# Altium schematic sheet DM1097_MIPI_IO.SchDoc: =project_title
size Tabloid; CompanyName: Luxonis Holding; Organization: Luxonis Holding; Address1: 1925 Harmony Park Drive; Address2: Westminster, CO; Address3: 80234; Address4: United States; SheetNumber: 13; SheetTotal: 17
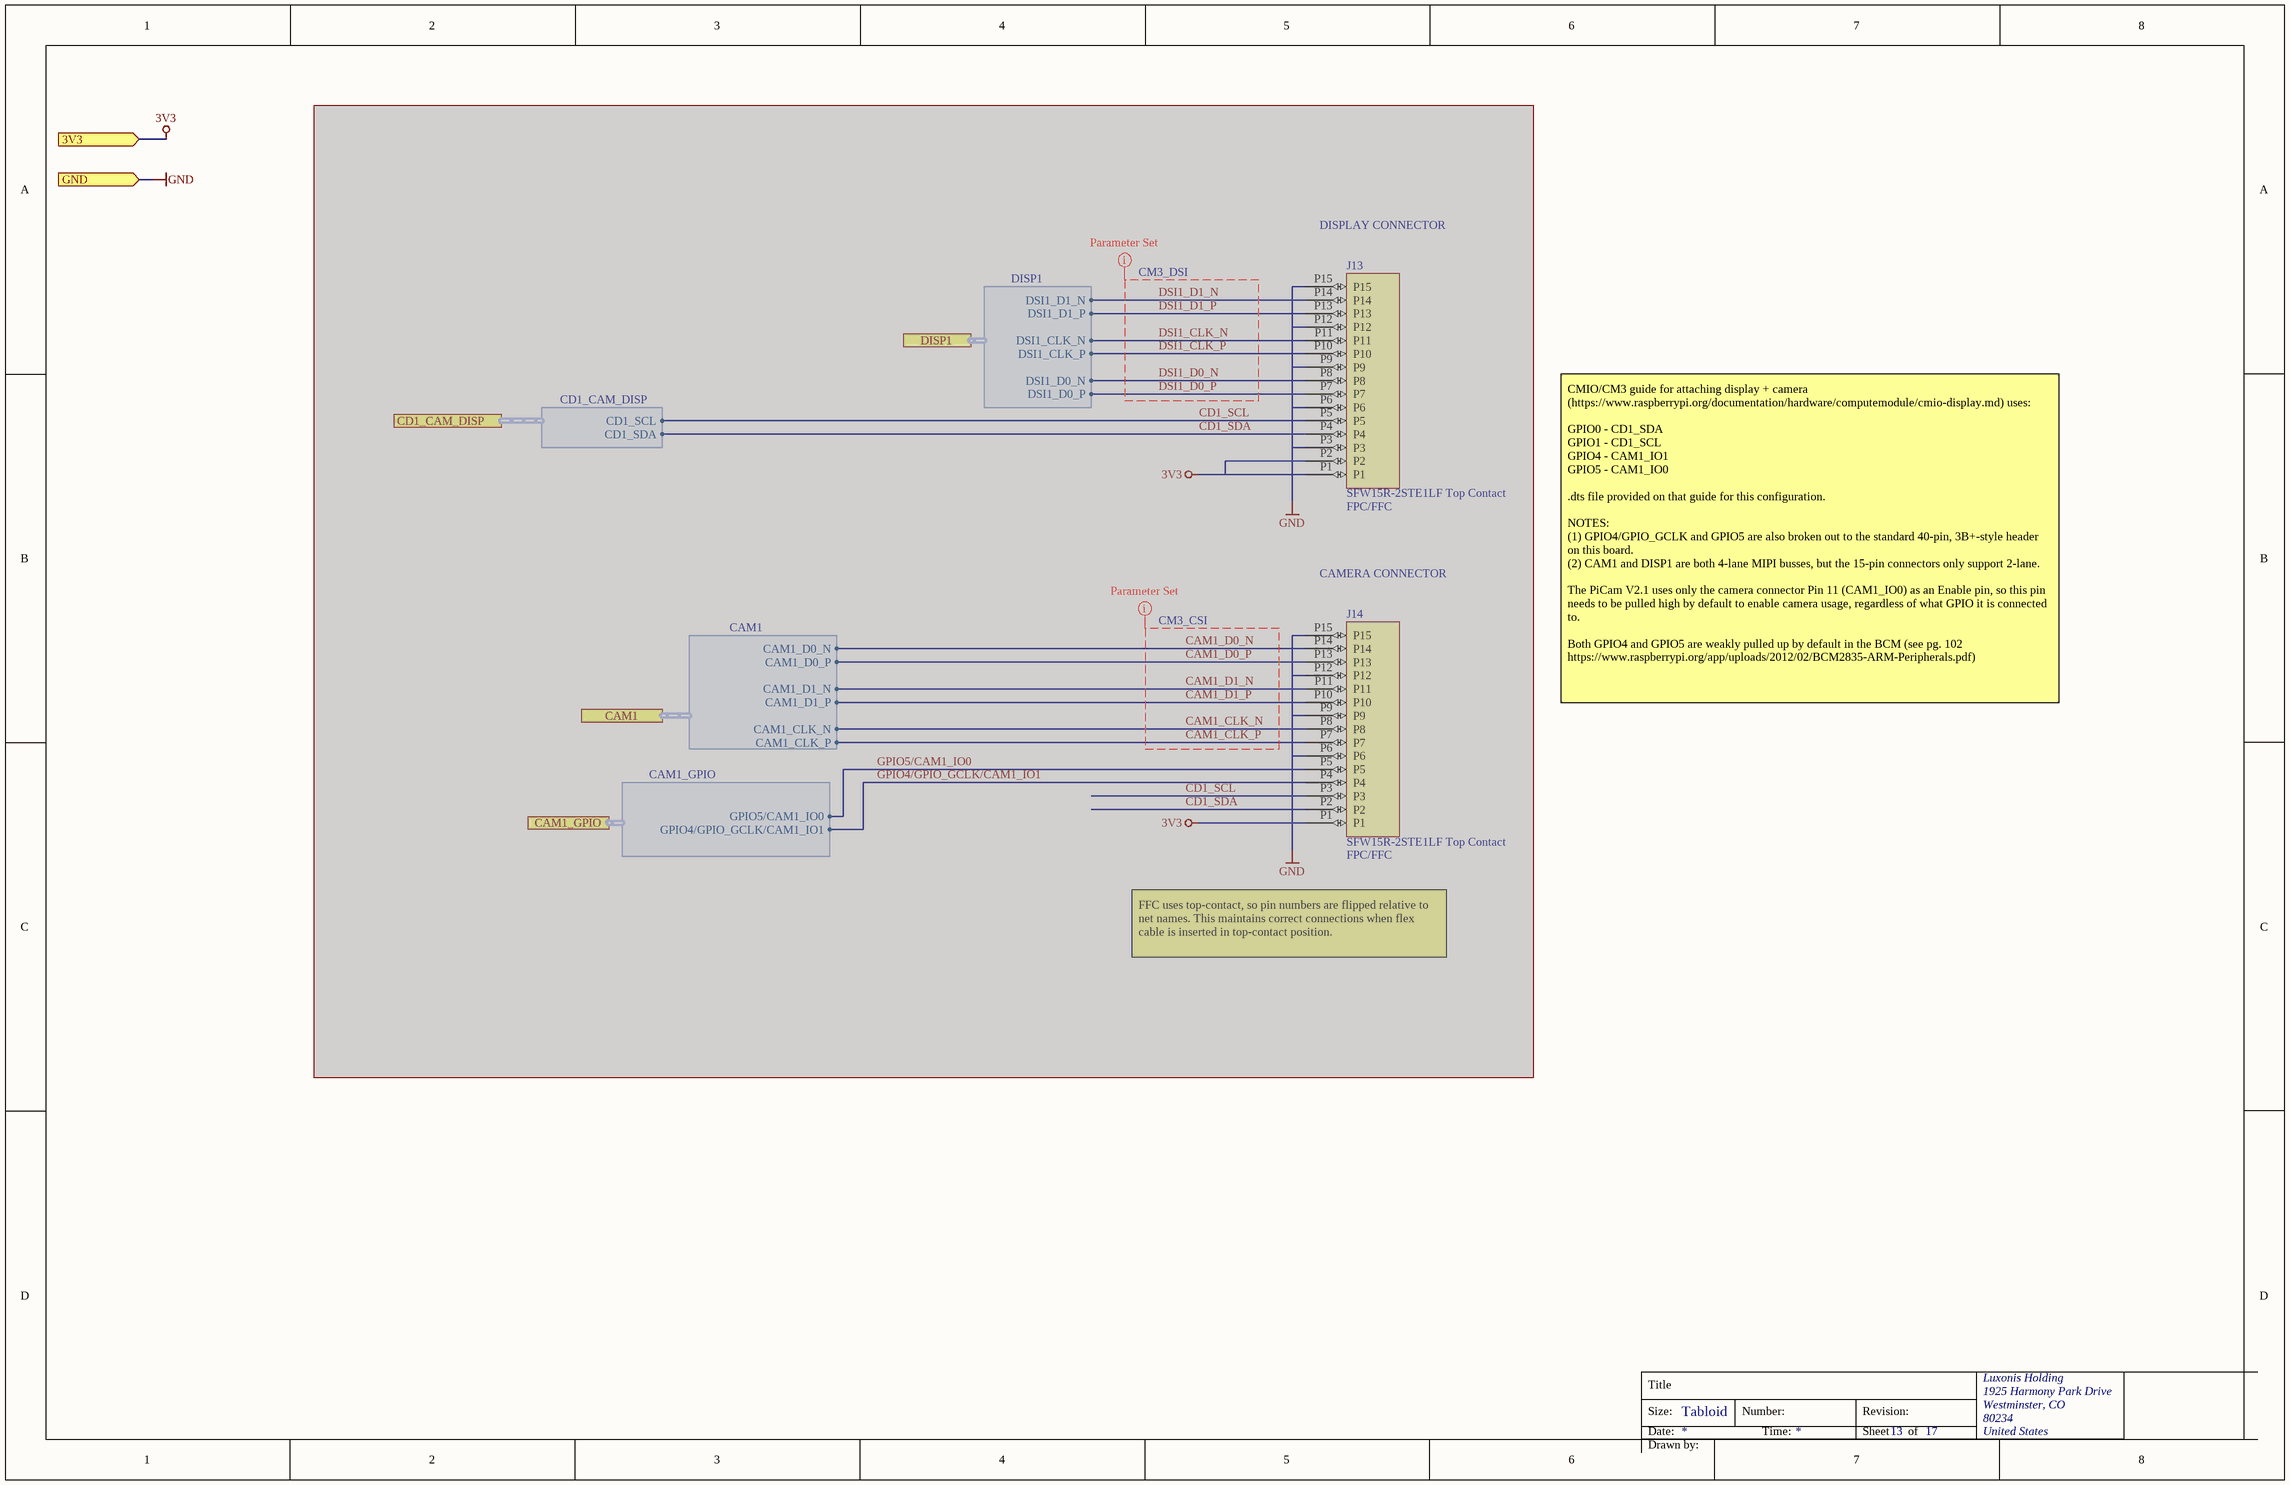
[diagram p0: DM1097_MIPI_IO.SchDoc]

## Parts
J13  SFW15R-2STE1LF Top Contact  Component Subtype: FPC/FFC  [SFW15R-2STE1LF]  (masked out: inside a compile mask, not in the netlist)
J14  SFW15R-2STE1LF Top Contact  Component Subtype: FPC/FFC  [SFW15R-2STE1LF]  (masked out: inside a compile mask, not in the netlist)

## Ports
3V3 (in), CAM1 (harness CAM1), CAM1_GPIO (harness CAM1_GPIO), CD1_CAM_DISP (harness CD1_CAM_DISP), DISP1 (harness DISP1), GND (in)

## Harnesses
CD1_CAM_DISP: CD1_SCL, CD1_SDA
CAM1: CAM1_D0_N, CAM1_D0_P, CAM1_D1_N, CAM1_D1_P, CAM1_CLK_N, CAM1_CLK_P
DISP1: DSI1_D1_N, DSI1_D1_P, DSI1_CLK_N, DSI1_CLK_P, DSI1_D0_N, DSI1_D0_P
CAM1_GPIO: GPIO4/GPIO_GCLK/CAM1_IO1, GPIO5/CAM1_IO0

## Nets
3V3: port 3V3
GND: port GND

## Layout directives
net class CM3_DSI; rule Matched Net Lengths [Tolerance = 5mil]: DSI1_CLK_N, DSI1_CLK_P, DSI1_D0_N, DSI1_D0_P, DSI1_D1_N, DSI1_D1_P
net class CM3_CSI; rule Matched Net Lengths [Tolerance = 5mil]: CAM1_CLK_N, CAM1_CLK_P, CAM1_D0_N, CAM1_D0_P, CAM1_D1_N, CAM1_D1_P

## Notes on the sheet
- DISPLAY CONNECTOR
- CAMERA CONNECTOR
- CMIO/CM3 guide for attaching display + camera (https://www.raspberrypi.org/documentation/hardware/computemodule/cmio-display.md) uses:
  GPIO0 - CD1_SDA
  GPIO1 - CD1_SCL
  GPIO4 - CAM1_IO1
  GPIO5 - CAM1_IO0
  .dts file provided on that guide for this configuration.
  NOTES:
  (1) GPIO4/GPIO_GCLK and GPIO5 are also broken out to the standard 40-pin, 3B+-style header on this board.
  (2) CAM1 and DISP1 are both 4-lane MIPI busses, but the 15-pin connectors only support 2-lane.
  The PiCam V2.1 uses only the camera connector Pin 11 (CAM1_IO0) as an Enable pin, so this pin needs to be pulled high by default to enable camera usage, regardless of what GPIO it is connected to.
  Both GPIO4 and GPIO5 are weakly pulled up by default in the BCM (see pg. 102 https://www.raspberrypi.org/app/uploads/2012/02/BCM2835-ARM-Peripherals.pdf)
- FFC uses top-contact, so pin numbers are flipped relative to net names. This maintains correct connections when flex cable is inserted in top-contact position.
- Title
- Size:
- Date:
- Tabloid
- Number:
- Time:
- Revision:
- Sheet
- of
- Drawn by:

## Library data of the parts
J13 J14 = SFW15R-2STE1LF: CONN FFC FPC TOP 15POS 1MM R/A; Manufacturer: Amphenol; Manufacturer 1: Amphenol FCI; Actuator Material: Glass; Current Rating: 1A; Voltage Rating: 100V; Contact Resistance: 30mR; Number of Positions: 15; Insulation Resistance: 500MR; Wire/Cable Type: Straight; Component Type: Connector; Mount: SMT; Manufacturer PN: SFW15R-2STE1LF; Supplier 1: Digi-Key; Manufacturer Part Number 1: SFW15R-2STE1LF; Stock 1: 4348; Pricing 1: 1=0.51000, 10=0.48200, 25=0.43400, 50=0.38580, 100=0.36960, 250=0.33748, 500=0.32142, 1000=0.26517 (USD); Contact Material: Bronze; Contact Plating: Tin; Housing Color: Brown; Housing Material: Polyphenylene; Min Operating Temperature: -55°C; Max Operating Temperature: 105°C; Packaging: Tape and Reel; Number of Rows: 1; Package Quantity: 2000; Voltage Rating (AC): 100V; Termination: Solder; Contact Location: Top; Number of Contacts: 15; Max Voltage Rating (AC): 100V; Orientation: Right Angle; Length: 20.8mm; Pitch: 1mm; Depth: 6mm; Width: 5.5mm; Lead Free: Lead Free; Flammability Rating: UL94 V-0; ComponentLink1URL: https://datasheet.ciiva.com/670/sfw12lf-670088.pdf?src-supplier=Digi-Key; ComponentLink1Description: https://datasheet.ciiva.com/670/sfw12lf-670088.pdf?src-supplier=Digi-Key; ComponentLink2URL: https://datasheet.ciiva.com/670/sfw12lf-670089.pdf?src-supplier=Digi-Key; ComponentLink2Description: https://datasheet.ciiva.com/670/sfw12lf-670089.pdf?src-supplier=Digi-Key; ComponentLink3URL: https://datasheet.ciiva.com/670/sfw12lf-670090.pdf?src-supplier=Digi-Key; ComponentLink3Description: https://datasheet.ciiva.com/670/sfw12lf-670090.pdf?src-supplier=Digi-Key; ComponentLink4URL: https://datasheet.ciiva.com/5138/sfw12lf-5138988.pdf?src-supplier=Mouser; ComponentLink4Description: https://datasheet.ciiva.com/5138/sfw12lf-5138988.pdf?src-supplier=Mouser; ComponentLink5URL: http://datasheet.octopart.com/SFW15R-2STE1LF-Areva-datasheet-119238.pdf?src-supplier=Mouser; ComponentLink5Description: http://datasheet.octopart.com/SFW15R-2STE1LF-Areva-datasheet-119238.pdf?src-supplier=Mouser; ComponentLink6URL: http://datasheet.octopart.com/SFW15R-2STE1LF-Areva-datasheet-8760026.pdf?src-supplier=_legacy+Avnet; ComponentLink6Description: http://datasheet.octopart.com/SFW15R-2STE1LF-Areva-datasheet-8760026.pdf?src-supplier=_legacy+Avnet; ComponentLink7URL: http://datasheet.octopart.com/SFW15R-2STE1LF-Amphenol-datasheet-94059633.pdf?src-supplier=Newark; ComponentLink7Description: http://datasheet.octopart.com/SFW15R-2STE1LF-Amphenol-datasheet-94059633.pdf?src-supplier=Newark; ComponentLink8URL: http://datasheet.octopart.com/SFW15R-2STE1LF-Amphenol-ICC-datasheet-94059633.pdf?src-supplier=Farnell; ComponentLink8Description: http://datasheet.octopart.com/SFW15R-2STE1LF-Amphenol-ICC-datasheet-94059633.pdf?src-supplier=Farnell; ComponentLink9URL: http://datasheet.octopart.com/SFW15R-2STE1LF-Amphenol-ICC-datasheet-8760026.pdf?src-supplier=Future+Electronics; ComponentLink9Description: http://datasheet.octopart.com/SFW15R-2STE1LF-Amphenol-ICC-datasheet-8760026.pdf?src-supplier=Future+Electronics; Supplier Part Number 1: 609-1906-1-ND; RoHS: Yes; Supplier 2: Digi-Key; Manufacturer 2: Amphenol FCI; Manufacturer Part Number 2: SFW15R-2STE1LF; Stock 2: 4348; Pricing 2: 1=0.51000, 10=0.48200, 25=0.43400, 50=0.38580, 100=0.36960, 250=0.33748, 500=0.32142, 1000=0.26517 (USD); Supplier 3: Mouser; Manufacturer 3: Amphenol FCI; Manufacturer Part Number 3: SFW15R-2STE1LF; Stock 3: 4218; Pricing 3: 1=0.46000, 10=0.35000, 100=0.33600, 500=0.29200, 1000=0.24100, 2000=0.21900, 4000=0.21100, 10000=0.19700, 24000=0.19400 (USD); Supplier Part Number 2: 609-1906-6-ND; Supplier Part Number 3: 649-SFW15R-2STE1LF